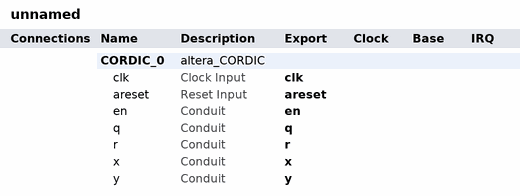
[diagram p0: system contents]
# Platform Designer (Qsys) system unnamed, Cyclone V 5CEBA4F23C7
# Parameters at their usual value, and those the tool derives, are not listed.
package require -exact qsys 17.0
create_system unnamed
set_project_property DEVICE_FAMILY {Cyclone V}
set_project_property DEVICE 5CEBA4F23C7

add_instance CORDIC_0 altera_CORDIC 17.0
set_instance_property CORDIC_0 AUTO_EXPORT true
set_instance_parameter_value CORDIC_0 ALL_function VECTRANSLATE
set_instance_parameter_value CORDIC_0 FUNCTION_FAMILY ALL
set_instance_parameter_value CORDIC_0 LUTSize 6
set_instance_parameter_value CORDIC_0 SFCompensation true
set_instance_parameter_value CORDIC_0 frequency_target 200
set_instance_parameter_value CORDIC_0 fxpt_in_fraction 0
set_instance_parameter_value CORDIC_0 fxpt_in_sign 1
set_instance_parameter_value CORDIC_0 fxpt_in_width 16
set_instance_parameter_value CORDIC_0 fxpt_out_fraction 14
set_instance_parameter_value CORDIC_0 fxpt_out_width 32
set_instance_parameter_value CORDIC_0 gen_enable true
set_instance_parameter_value CORDIC_0 latency_target 2
set_instance_parameter_value CORDIC_0 performance_goal frequency
set_instance_parameter_value CORDIC_0 report_resources_to_xml false
set_instance_parameter_value CORDIC_0 selected_device_family {Cyclone V}
set_instance_parameter_value CORDIC_0 selected_device_speedgrade 7
set_instance_parameter_value CORDIC_0 specifyLUTs false
set_instance_parameter_value CORDIC_0 useLUTs false

# exported interfaces
add_interface areset reset sink
set_interface_property areset EXPORT_OF CORDIC_0.areset
add_interface clk clock sink
set_interface_property clk EXPORT_OF CORDIC_0.clk
add_interface en conduit end
set_interface_property en EXPORT_OF CORDIC_0.en
add_interface q conduit end
set_interface_property q EXPORT_OF CORDIC_0.q
add_interface r conduit end
set_interface_property r EXPORT_OF CORDIC_0.r
add_interface x conduit end
set_interface_property x EXPORT_OF CORDIC_0.x
add_interface y conduit end
set_interface_property y EXPORT_OF CORDIC_0.y

set_interconnect_requirement {$system} qsys_mm.clockCrossingAdapter HANDSHAKE
set_interconnect_requirement {$system} qsys_mm.enableEccProtection FALSE
set_interconnect_requirement {$system} qsys_mm.insertDefaultSlave FALSE
set_interconnect_requirement {$system} qsys_mm.maxAdditionalLatency 1

save_system unnamed.qsys
